# EAGLE design LM1875_AmpCircuit (EAGLE 9.2.0)
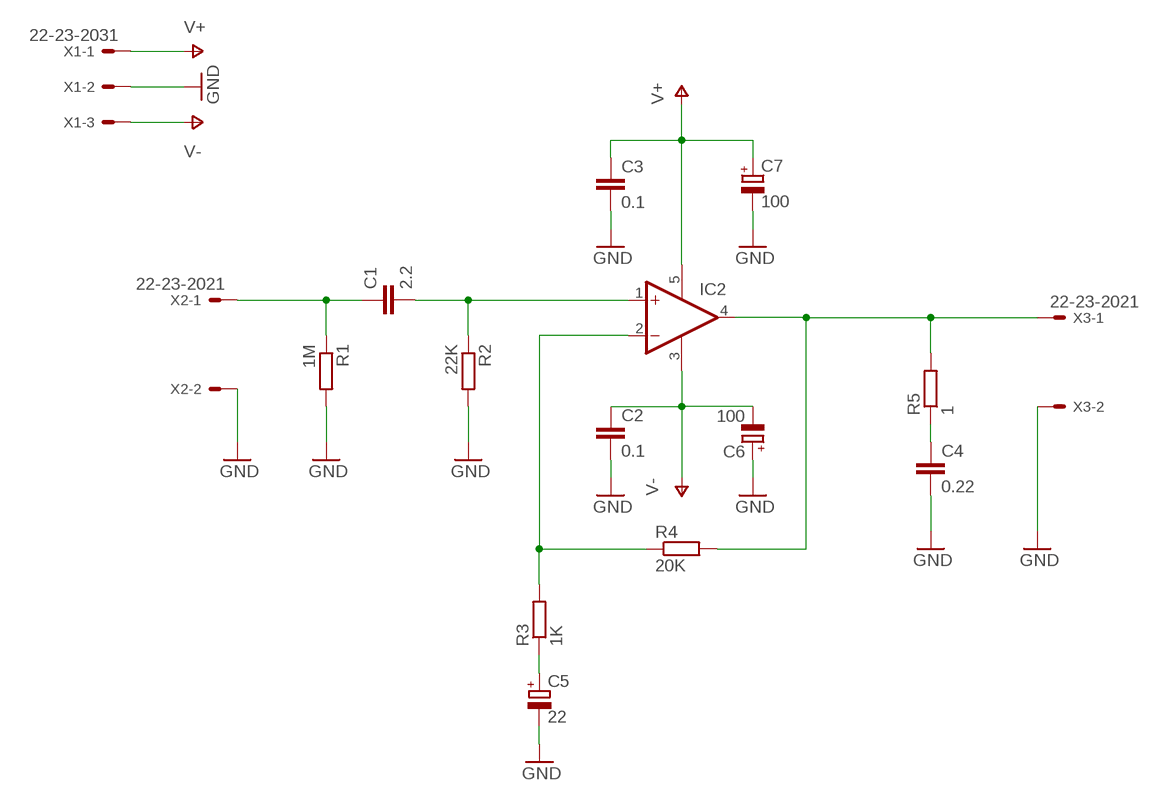
[diagram p0: schematic, sheet 1]

## Parts
C1  2.2  C-EU050-024X044  [C050-024X044]
C2  0.1  C-EU050-024X044  [C050-024X044]
C3  0.1  C-EU050-024X044  [C050-024X044]
C4  0.22  C-EU050-024X044  [C050-024X044]
C5  22  CPOL-EUE3.5-10  [E3,5-10]
C6  100  CPOL-EUE3.5-10  [E3,5-10]
C7  100  CPOL-EUE3.5-10  [E3,5-10]
IC2  LM1875TO220-5  [CB360]
R1  1M  R-EU_0204/7  [0204/7]
R2  22K  R-EU_0204/7  [0204/7]
R3  1K  R-EU_0204/7  [0204/7]
R4  20K  R-EU_0204/7  [0204/7]
R5  1  R-EU_0204/7  [0204/7]
X1  22-23-2031  [22-23-2031]
X2  22-23-2021  [22-23-2021]
X3  22-23-2021  [22-23-2021]

## Nets
GND: C2.2 C3.2 C4.2 C5.- C6.+ C7.- R1.2 R2.2 X1.2 X2.2 X3.2
N$1: C1.1 R1.1 X2.1
N$2: C1.2 IC2.1(+IN) R2.1
N$3: C5.+ R3.1
N$4: IC2.2(-IN) R3.2 R4.1
N$5: IC2.4(OUT) R4.2 R5.2 X3.1
N$6: C4.1 R5.1
V+: C3.1 C7.+ IC2.5(V+) X1.1
V-: C2.1 C6.- IC2.3(V-) X1.3

## Library data of the parts
C1-C4 = rcl:C-EU: CAPACITOR, European symbol; SPICEPREFIX: C
C5-C7 = rcl:CPOL-EU: POLARIZED CAPACITOR, European symbol; SPICEPREFIX: C
IC2 = Audio-Power-amlifier V.2.0:LM1875: The LM1875 is a monolithic power amplifier offering very low distortion and high quality performance for consumer audio applications. The LM1875 delivers 20 watts into a 4Ω or 8Ω load on ±25V supplies. Using an 8Ω load and ±30V supplies, over 30 watts of power may be delivered. The amplifier is designed to operate with a minimum of external components. Device overload protection consists of both internal current limit and thermal shutdown. The LM1875 design takes advantage of advanced circuit techniques and processing to achieve extremely low distortion levels even at high output power levels. Other outstanding features include high gain, fast slew rate and a wide power bandwidth, large output voltage swing, high current capability, and a very wide supply range. The amplifier is internally compensated and stable for gains of 10 or greater.
R1-R5 = rcl:R-EU_: RESISTOR, European symbol; SPICEPREFIX: R
X1 = con-molex:22-23-2031: .100" (2.54mm) Center Header - 3 Pin; MF: MOLEX; MPN: 22-23-2031; OC_FARNELL: 1462950; OC_NEWARK: 30C0862
X2 X3 = con-molex:22-23-2021: .100" (2.54mm) Center Header - 2 Pin; MF: MOLEX; MPN: 22-23-2021; OC_FARNELL: 1462926; OC_NEWARK: 25C3832

## Board
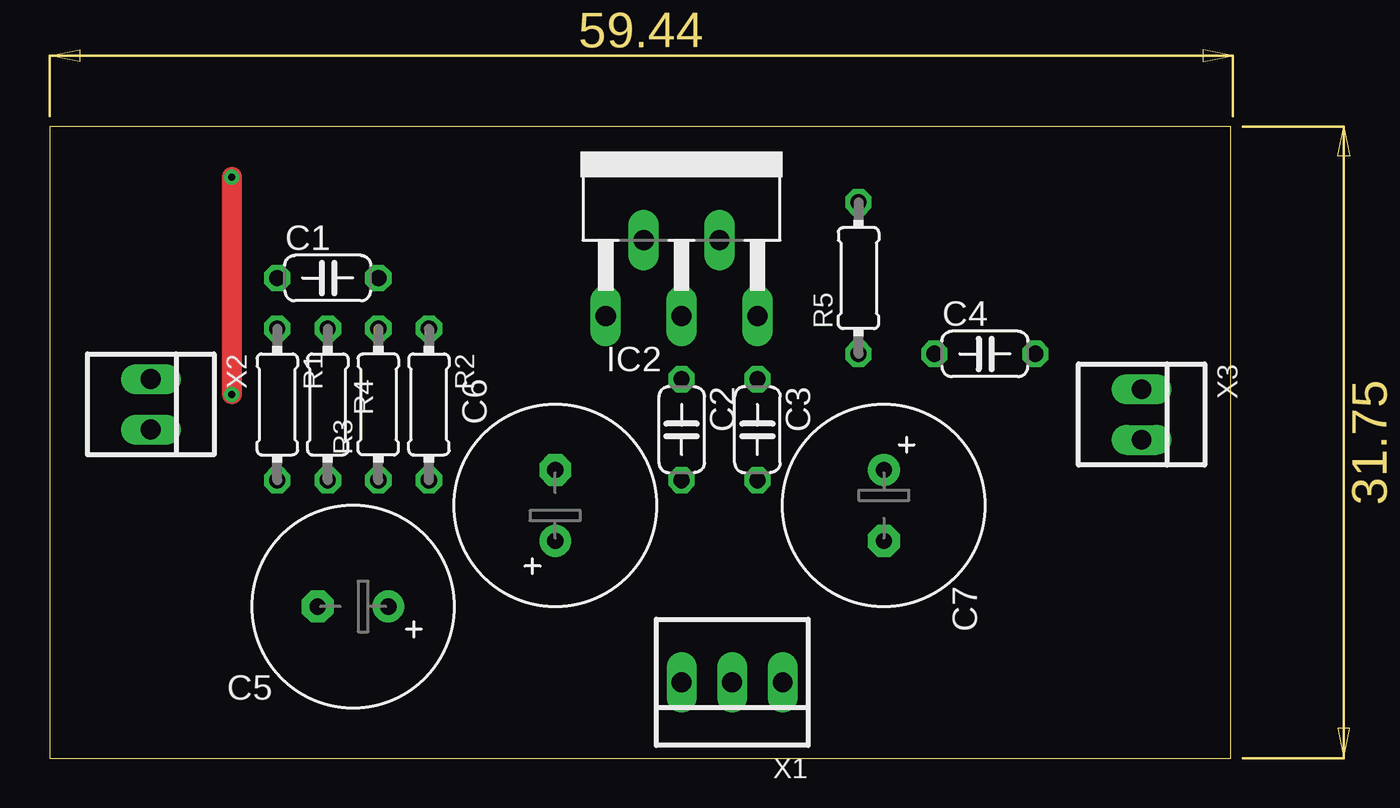
[diagram p1: board, top side]
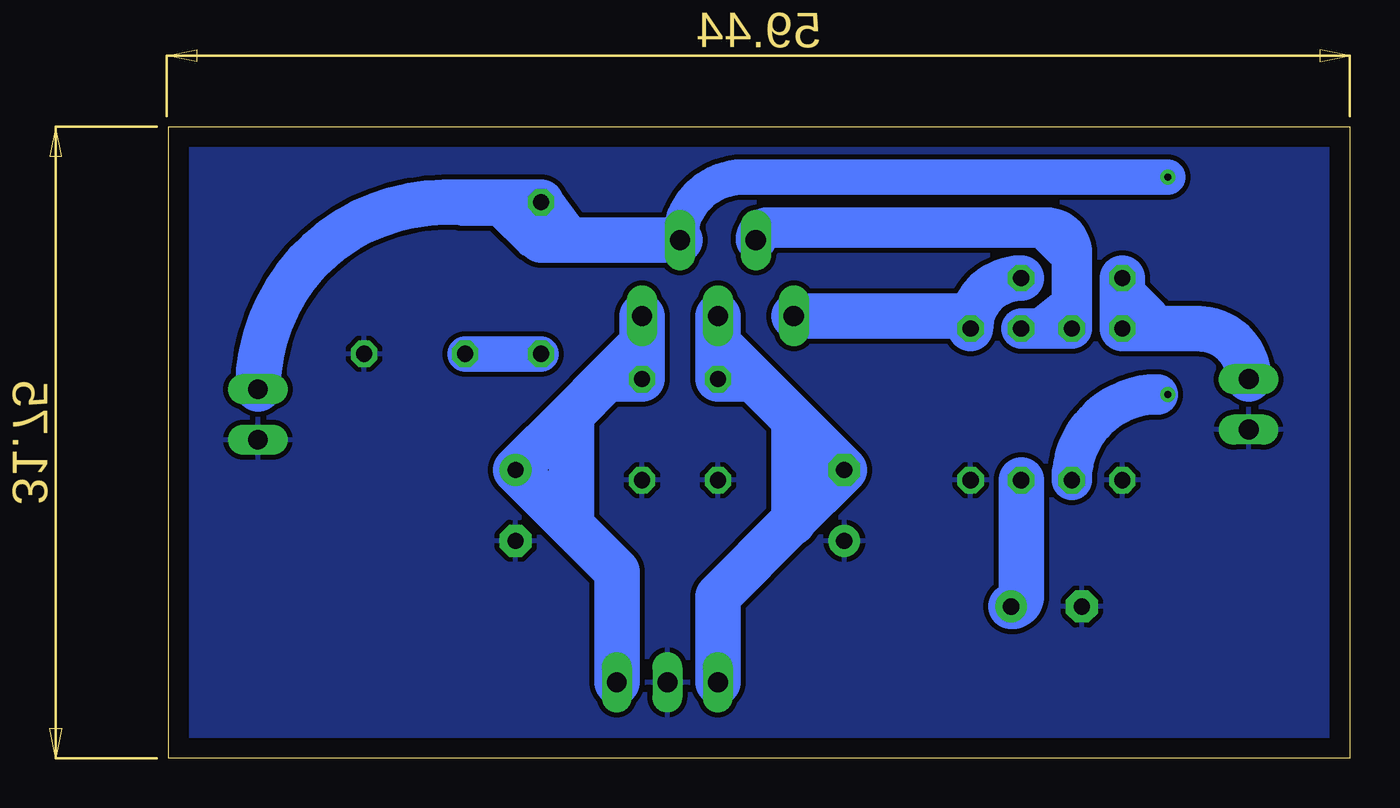
[diagram p2: board, bottom side, seen from below]

Size 59.36 x 31.74 mm. Coordinates in mm from the lower left corner, seen from the top.
Outline: 0,0 59.36,0 59.36,31.74 0,31.74 0,0
Copper layers (1*16): Top 0.035mm / dielectric 1.5mm / Bottom 0.035mm
Design rules "default *": minimum track width 6mil, minimum drill 0.35mm, track to track 10mil, track to pad 10mil, pad to pad 10mil, via to via 10mil, smd to smd 10mil, copper to edge 40mil, drill to drill 6mil, minimum pad ring 10mil, minimum via ring 8mil, stop-mask expansion 4mil, vias tented up to drill 0mil, thermal gap 10mil

### Footprints (pad centres in the part's own frame; a part is rotated, then mirrored left to right if it is on the bottom)
C050-024X044 = drill 0.813 octagon: 1 -2.54,0; 2 2.54,0
E3,5-10 = drill 0.813 pad 1.6: + -1.778,0 | drill 0.813 pad 1.6 octagon: - 1.778,0
CB360 = drill 1.016 long: 1 -3.81,-8.255; 2 -1.905,-4.445; 3 0,-8.255; 4 1.905,-4.445; 5 3.81,-8.255
0204/7 = drill 0.813 octagon: 1 -3.81,0; 2 3.81,0
22-23-2031 = drill 1 long: 1 -2.54,0; 2 0,0; 3 2.54,0
22-23-2021 = drill 1 long: 1 -1.27,0; 2 1.27,0

### Placement (x,y rotation side)
C1  13.97,24.13 0 top
C2  31.75,16.51 270 top
C3  35.56,16.51 270 top
C4  46.99,20.32 0 top
C5  15.24,7.62 180 top
C6  25.4,12.7 90 top
C7  41.91,12.7 270 top
IC2  31.75,30.48 0 top
R1  11.43,17.78 270 top
R2  19.05,17.78 270 top
R3  16.51,17.78 90 top
R4  13.97,17.78 270 top
R5  40.64,24.13 90 top
X1  34.29,3.81 180 top
X2  5.08,17.78 270 top
X3  54.86,17.27 270 top

### Tracks (layer width: path | path; a pad name or v marks a point on that pad's centre or on a via)
GND
  pour Bottom: -1.27,33.02 60.96,33.02 60.96,-1.27 -1.27,-1.27
N$1
  Bottom 0.813: C1.1 11.18,24.13 9.65,22.61
  Bottom 1.016: X2.1 arc-90 7.62,21.59
  Bottom 2.286: X2.1 arc-90 7.62,21.59 R1.1 C1.1
N$2
  Bottom 1.016: C1.2 arc-90 R2.1 27.3,21.59 arc90 IC2.1
  Bottom 2.286: C1.2 arc-90 R2.1 arc-90 19.68,22.23 IC2.1
N$3
  Bottom 1.016: 16.51,8.13 arc90 C5.+
  Bottom 2.286: C5.+ arc-90 16.51,8.13 R3.1
N$4
  Bottom 0.813: 13.97,23.62 R3.2 | 16.26,26.67 14.73,25.15
  Bottom 1.016: 13.97,25.4 arc-90 15.24,26.67 | 29.21,26.67 arc-90 IC2.2
  Bottom 2.032: IC2.2 arc90 29.21,26.67 16.26,26.67 15.24,26.67 arc90 13.97,25.4 13.97,23.62 R4.1 R3.2
N$5  (via drill 0.35)
  Top 1.016: v9.14,29.21 v9.14,18.29
  Bottom 0.152: IC2.4 37.21,26.04 37.85,26.67
  Bottom 0.813: 38.35,26.04 40.13,28.45 43.43,27.94 | 40.64,26.04 42.67,27.43 44.7,27.18 42.93,27.18 41.4,25.65
  Bottom 1.016: R4.2 arc90 9.65,18.29 v9.14,18.29 | IC2.4 arc90 30.48,29.21
  Bottom 1.778: v9.14,29.21 30.48,29.21 arc-90 IC2.4
  Bottom 2.032: R4.2 arc90 9.65,18.29
  Bottom 2.286: IC2.4 38.35,26.04 40.64,26.04 R5.2 43.43,27.94 45.47,27.94 arc-90 X3.1
N$6
  Bottom 1.778: C4.1 R5.1
V+
  Bottom 2.286: 37.34,19.05 C3.1 IC2.5 35.56,20.83 37.34,19.05 | 37.34,19.05 39.12,17.27 | 39.12,17.27 C7.+ 39.37,11.94 | 39.37,11.94 36.83,9.4 X1.1 | 39.12,17.27 39.12,12.19 arc90 39.37,11.94
V-
  Bottom 2.286: 29.97,19.05 C2.1 IC2.3 31.75,20.83 29.97,19.05 | 29.97,19.05 27.94,17.02 | 27.94,17.02 C6.- 28.07,11.81 | 28.07,11.81 31.75,8.13 X1.3 | 27.94,17.02 27.94,11.94 arc90 28.07,11.81